# Altium schematic sheet ModuleCarrier.SchDoc
size A4; SheetNumber: 2; SheetTotal: 15
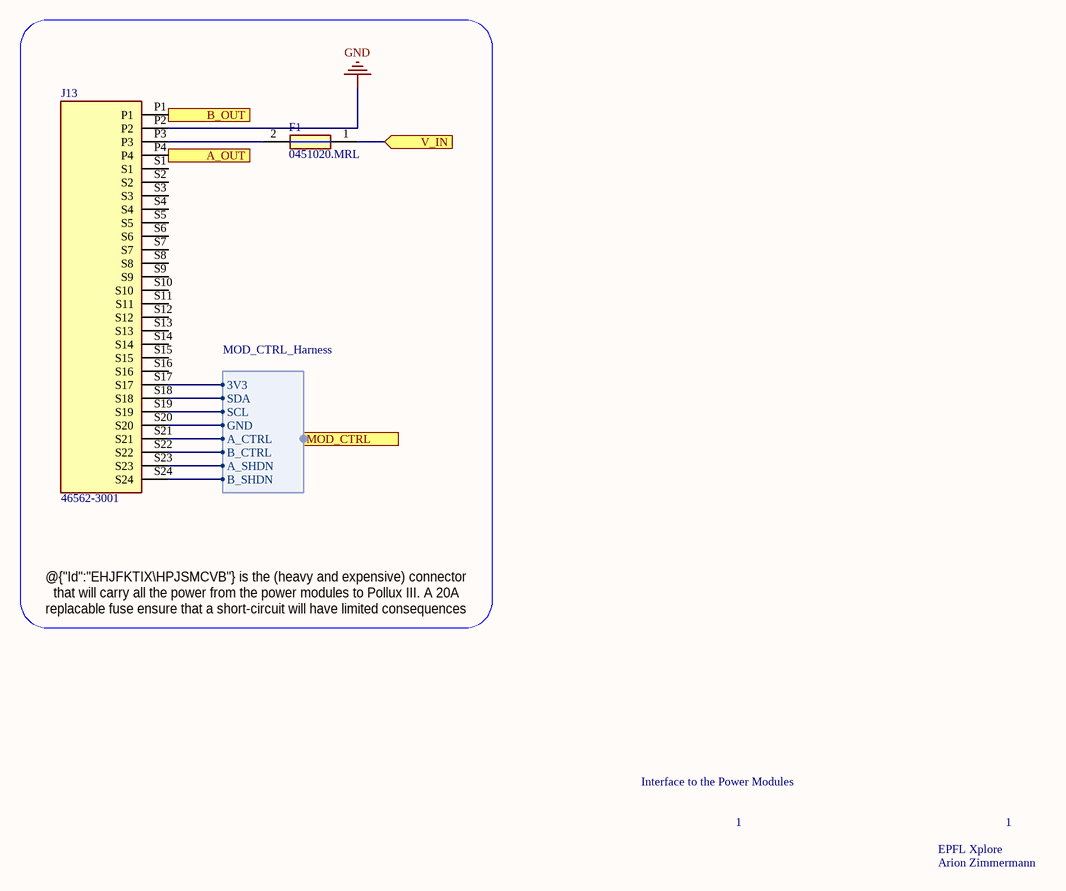
[diagram p0: ModuleCarrier.SchDoc]

## Parts
F1  0451020.MRL  [FUSC6127X294N]
J13  46562-3001  [465623001]

## Ports
A_OUT (out), B_OUT (out), MOD_CTRL (harness MOD_CTRL_Harness), V_IN (in)

## Harnesses
MOD_CTRL_Harness: B_SHDN, A_SHDN, B_CTRL, A_CTRL, GND, SCL, SDA, 3V3

## Nets
GND: J13.P2
A_OUT: J13.P4 ; port A_OUT
B_OUT: J13.P1 ; port B_OUT
V_IN: F1.1 ; port V_IN
NetF1_2: F1.2 J13.P3
NetJ13_S17: J13.S17 ; port MOD_CTRL.3V3
NetJ13_S18: J13.S18 ; port MOD_CTRL.SDA
NetJ13_S19: J13.S19 ; port MOD_CTRL.SCL
NetJ13_S20: J13.S20 ; port MOD_CTRL.GND
NetJ13_S21: J13.S21 ; port MOD_CTRL.A_CTRL
NetJ13_S22: J13.S22 ; port MOD_CTRL.B_CTRL
NetJ13_S23: J13.S23 ; port MOD_CTRL.A_SHDN
NetJ13_S24: J13.S24 ; port MOD_CTRL.B_SHDN

Not connected (* = marked no-connect by the designer): J13 S1 S2 S3 S4 S5 S6 S7 S8 S9 S10 S11 S12 S13 S14 S15 S16

## Notes on the sheet
- @{"Id":"EHJFKTIX\HPJSMCVB"} is the (heavy and expensive) connector that will carry all the power from the power modules to Pollux III. A 20A replacable fuse ensure that a short-circuit will have limited consequences to the rest of the system.
- Interface to the Power Modules
- 1
- EPFL Xplore
- Arion Zimmermann

## Library data of the parts
F1 = 0451020.MRL: Fuse; Manufacturer_Name: LITTELFUSE; Datasheet Link: https://m.littelfuse.com/~/media/electronics/datasheets/fuses/littelfuse_fuse_451_453_datasheet.pdf.pdf; Height: 2.94mm; Manufacturer_Part_Number: 0451020.MRL; Mouser Part Number: 576-0451020.MRL; Mouser Price/Stock: https://www.mouser.co.uk/ProductDetail/Littelfuse/0451020MRL?qs=ZaMXuU%252B6JZZbQqgd%2F3uvYw%3D%3D; Arrow Part Number: 0451020.MRL; Arrow Price/Stock: https://www.arrow.com/en/products/0451020.mrl/littelfuse
J13 = 46562-3001: Connector; System: Connector